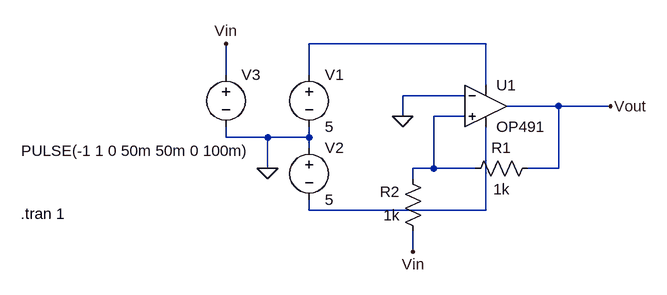
[diagram p0: schematic AnalogInverter.asc]
AnalogInverter.asc, the LTspice schematic file:
Version 4
SHEET 1 880 680
WIRE 192 96 -80 96
WIRE -208 144 -208 96
WIRE -80 144 -80 96
WIRE 192 160 192 96
WIRE 160 176 64 176
WIRE 304 192 224 192
WIRE 384 192 304 192
WIRE 64 208 64 176
WIRE 160 208 112 208
WIRE -208 240 -208 224
WIRE -144 240 -208 240
WIRE -80 240 -80 224
WIRE -80 240 -144 240
WIRE -80 256 -80 240
WIRE -144 288 -144 240
WIRE 112 288 112 208
WIRE 112 288 80 288
WIRE 176 288 112 288
WIRE 304 288 304 192
WIRE 304 288 256 288
WIRE 80 304 80 288
WIRE -80 352 -80 336
WIRE 192 352 192 224
WIRE 192 352 -80 352
WIRE 80 416 80 384
FLAG -144 288 0
FLAG 384 192 Vout
FLAG -208 96 Vin
FLAG 64 208 0
FLAG 80 416 Vin
SYMBOL voltage -80 128 R0
SYMATTR InstName V1
SYMATTR Value 5
SYMBOL voltage -80 240 R0
SYMATTR InstName V2
SYMATTR Value 5
SYMBOL voltage -208 128 R0
WINDOW 3 -315 133 Left 2
WINDOW 123 0 0 Left 0
WINDOW 39 0 0 Left 0
SYMATTR InstName V3
SYMATTR Value PULSE(-1 1 0 50m 50m 0 100m)
SYMBOL res 272 272 R90
WINDOW 0 0 56 VBottom 2
WINDOW 3 32 56 VTop 2
SYMATTR InstName R1
SYMATTR Value 1k
SYMBOL res 96 400 R180
WINDOW 0 36 76 Left 2
WINDOW 3 36 40 Left 2
SYMATTR InstName R2
SYMATTR Value 1k
SYMBOL Opamps\\OP491 192 128 R0
SYMATTR InstName U1
TEXT -524 358 Left 2 !.tran 1

The netlist it stands for:
* AnalogInverter.asc
V1 N001 0 5
V2 0 N003 5
V3 Vin 0 PULSE(-1 1 0 50m 50m 0 100m)
R1 Vout N002 1k
R2 Vin N002 1k
XU1 N002 0 N001 N003 Vout OP491  ; pins In+ In- V+ V- OUT
.tran 1
.backanno
.end